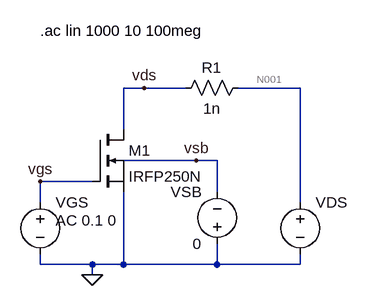
[diagram p0: schematic analisis_AC_Mosfet.asc]
analisis_AC_Mosfet.asc, the LTspice schematic file:
Version 4
SHEET 1 1256 680
WIRE 80 0 48 0
WIRE 144 0 80 0
WIRE 320 0 224 0
WIRE 48 64 48 0
WIRE 160 112 48 112
WIRE 192 112 160 112
WIRE 0 144 -80 144
WIRE 192 160 192 112
WIRE -80 176 -80 144
WIRE 320 176 320 0
WIRE -80 272 -80 256
WIRE 0 272 -80 272
WIRE 48 272 48 160
WIRE 48 272 0 272
WIRE 192 272 192 240
WIRE 192 272 48 272
WIRE 320 272 320 256
WIRE 320 272 192 272
WIRE 0 288 0 272
FLAG 0 288 0
FLAG -80 144 vgs
FLAG 80 0 vds
FLAG 160 112 vsb
SYMBOL voltage -80 160 R0
WINDOW 3 24 96 Invisible 2
WINDOW 123 24 44 Left 2
WINDOW 39 0 0 Left 0
SYMATTR Value 4.5
SYMATTR Value2 AC 0.1 0
SYMATTR InstName VGS
SYMBOL voltage 320 160 R0
WINDOW 3 24 96 Invisible 2
WINDOW 123 0 0 Left 0
WINDOW 39 0 0 Left 0
SYMATTR Value 10
SYMATTR InstName VDS
SYMBOL voltage 192 256 R180
WINDOW 0 24 96 Left 2
WINDOW 3 24 16 Left 2
SYMATTR InstName VSB
SYMATTR Value 0
SYMBOL res 240 -16 R90
WINDOW 0 0 56 VBottom 2
WINDOW 3 32 56 VTop 2
SYMATTR InstName R1
SYMATTR Value 1n
SYMBOL nmos 0 64 R0
SYMATTR InstName M1
SYMATTR Value IRFP250N
TEXT -80 -88 Left 2 !.ac lin 1000 10 100meg

The netlist it stands for:
* analisis_AC_Mosfet.asc
VGS vgs 0 4.5 AC 0.1 0
VDS N001 0 10
VSB 0 vsb 0
R1 N001 vds 1n
M1 vds vgs 0 0 IRFP250N
.model NMOS NMOS
.model PMOS PMOS
.lib standard.mos
.ac lin 1000 10 100meg
.backanno
.end

* Results of the author's LTspice run, read from the files saved beside the schematic
* Operating Point, zero values left out:
*   V(vgs) = 4.5 V
*   V(n001) = 10 V
*   V(vds) = 10 V
*   Id(M1) = 1.629 A
*   Ig(M1) = -369.5 pA
*   Is(M1) = -1.629 A
*   I(R1) = 1.629 A
*   I(Vds) = -1.629 A
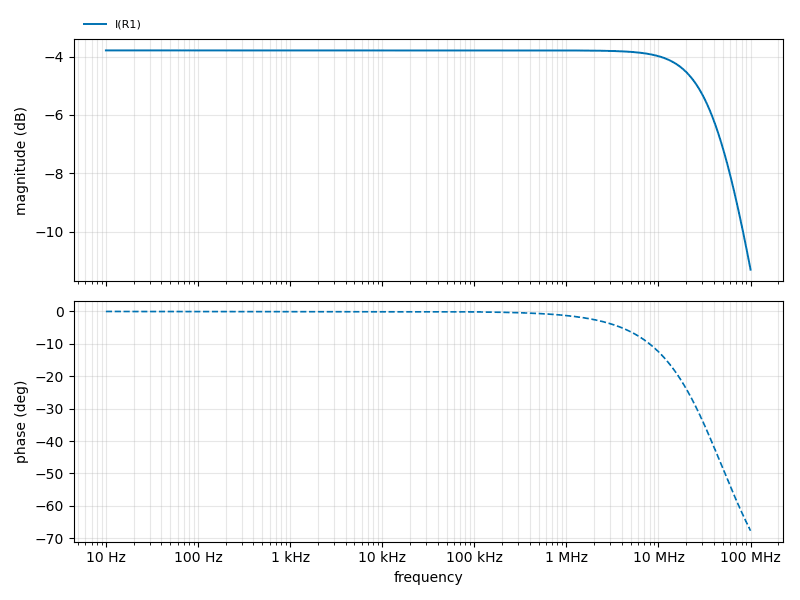
[diagram p1: AC Analysis of analisis_AC_Mosfet.asc, plotted from the saved traces]
* AC Analysis, 1 run:
*   I(R1): -3.79 dB at 10 Hz, -11.31 dB at 100 MHz, peak -3.79 dB at 10 Hz, 3 dB below the peak at 46.37 MHz